# EAGLE design ssl (EAGLE 6.5.0)
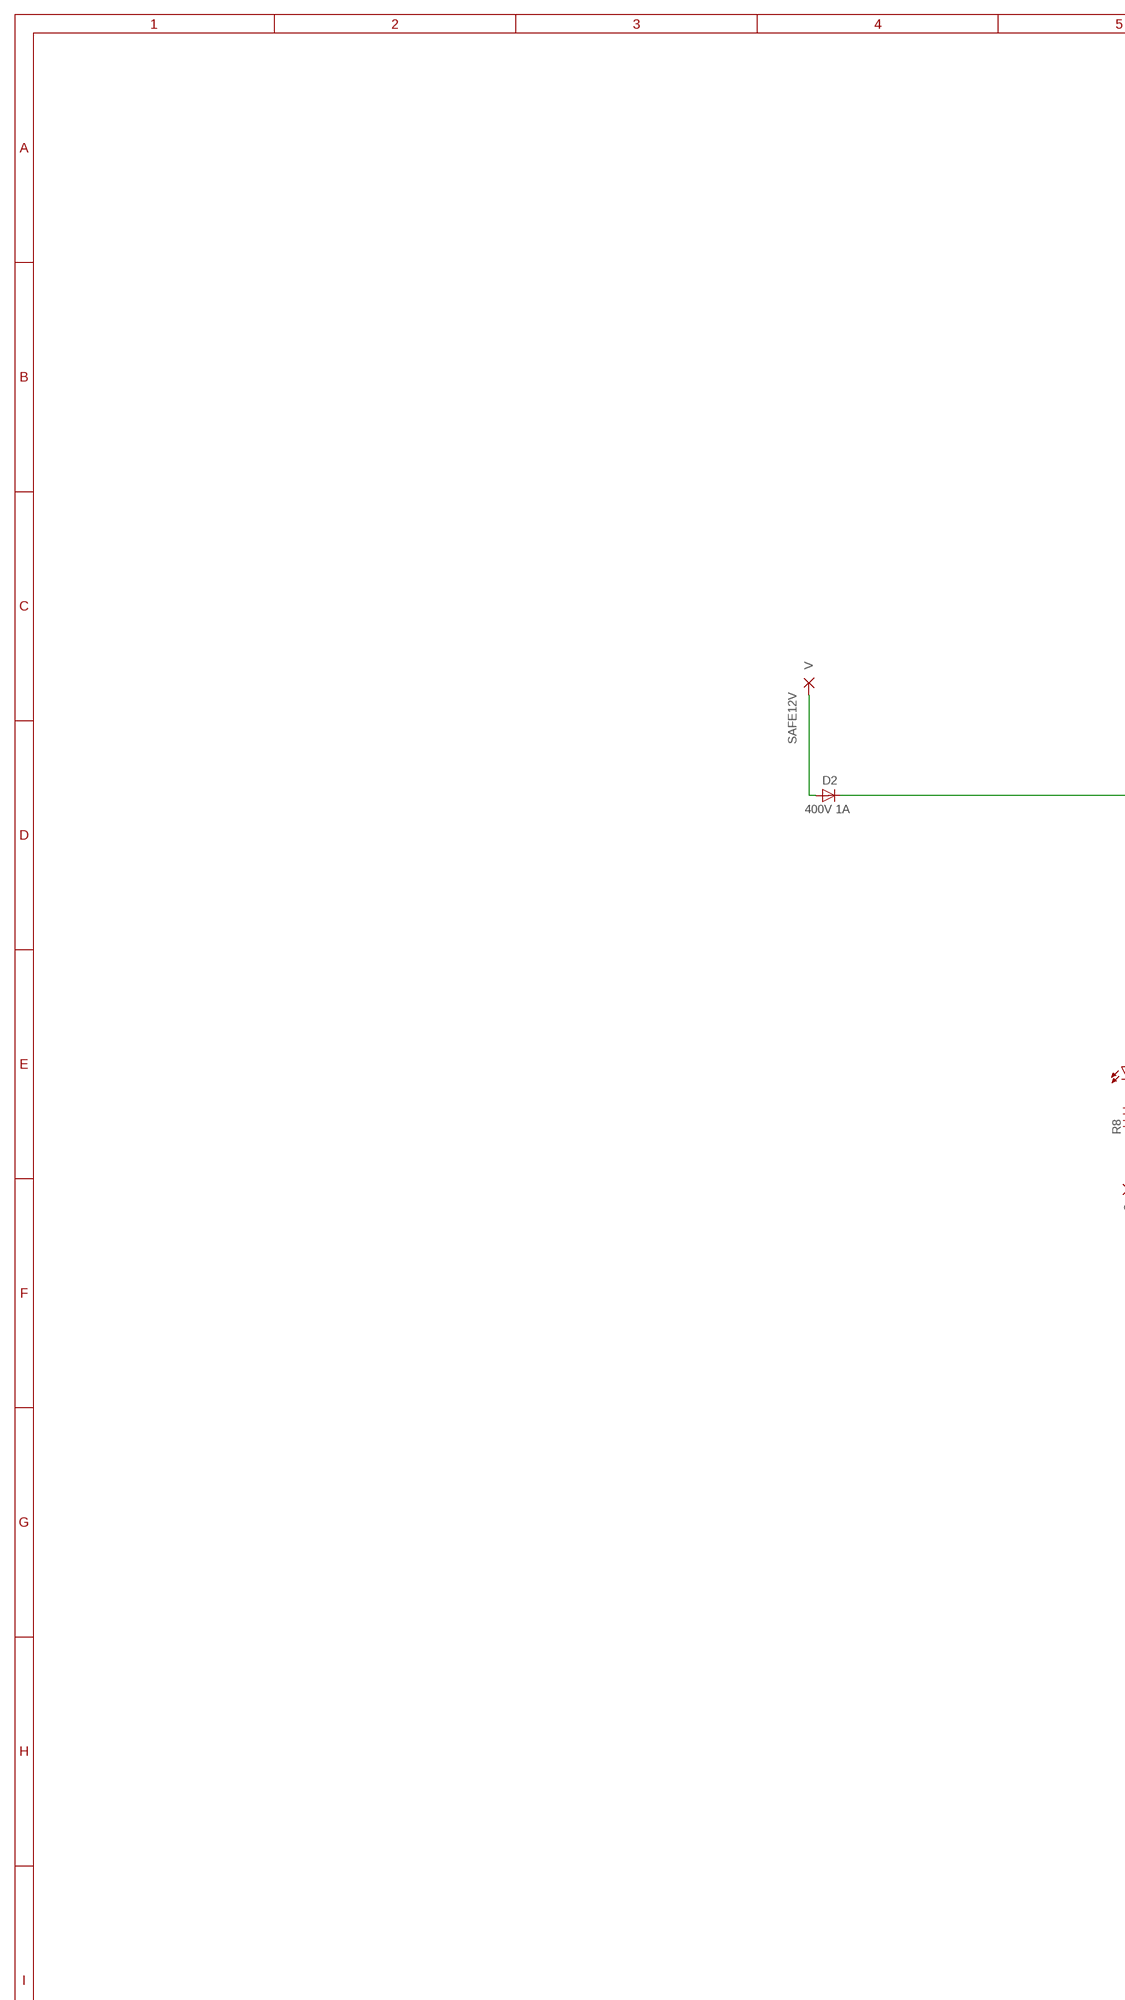
[diagram p0: schematic, sheet 1, part 1 of 2]
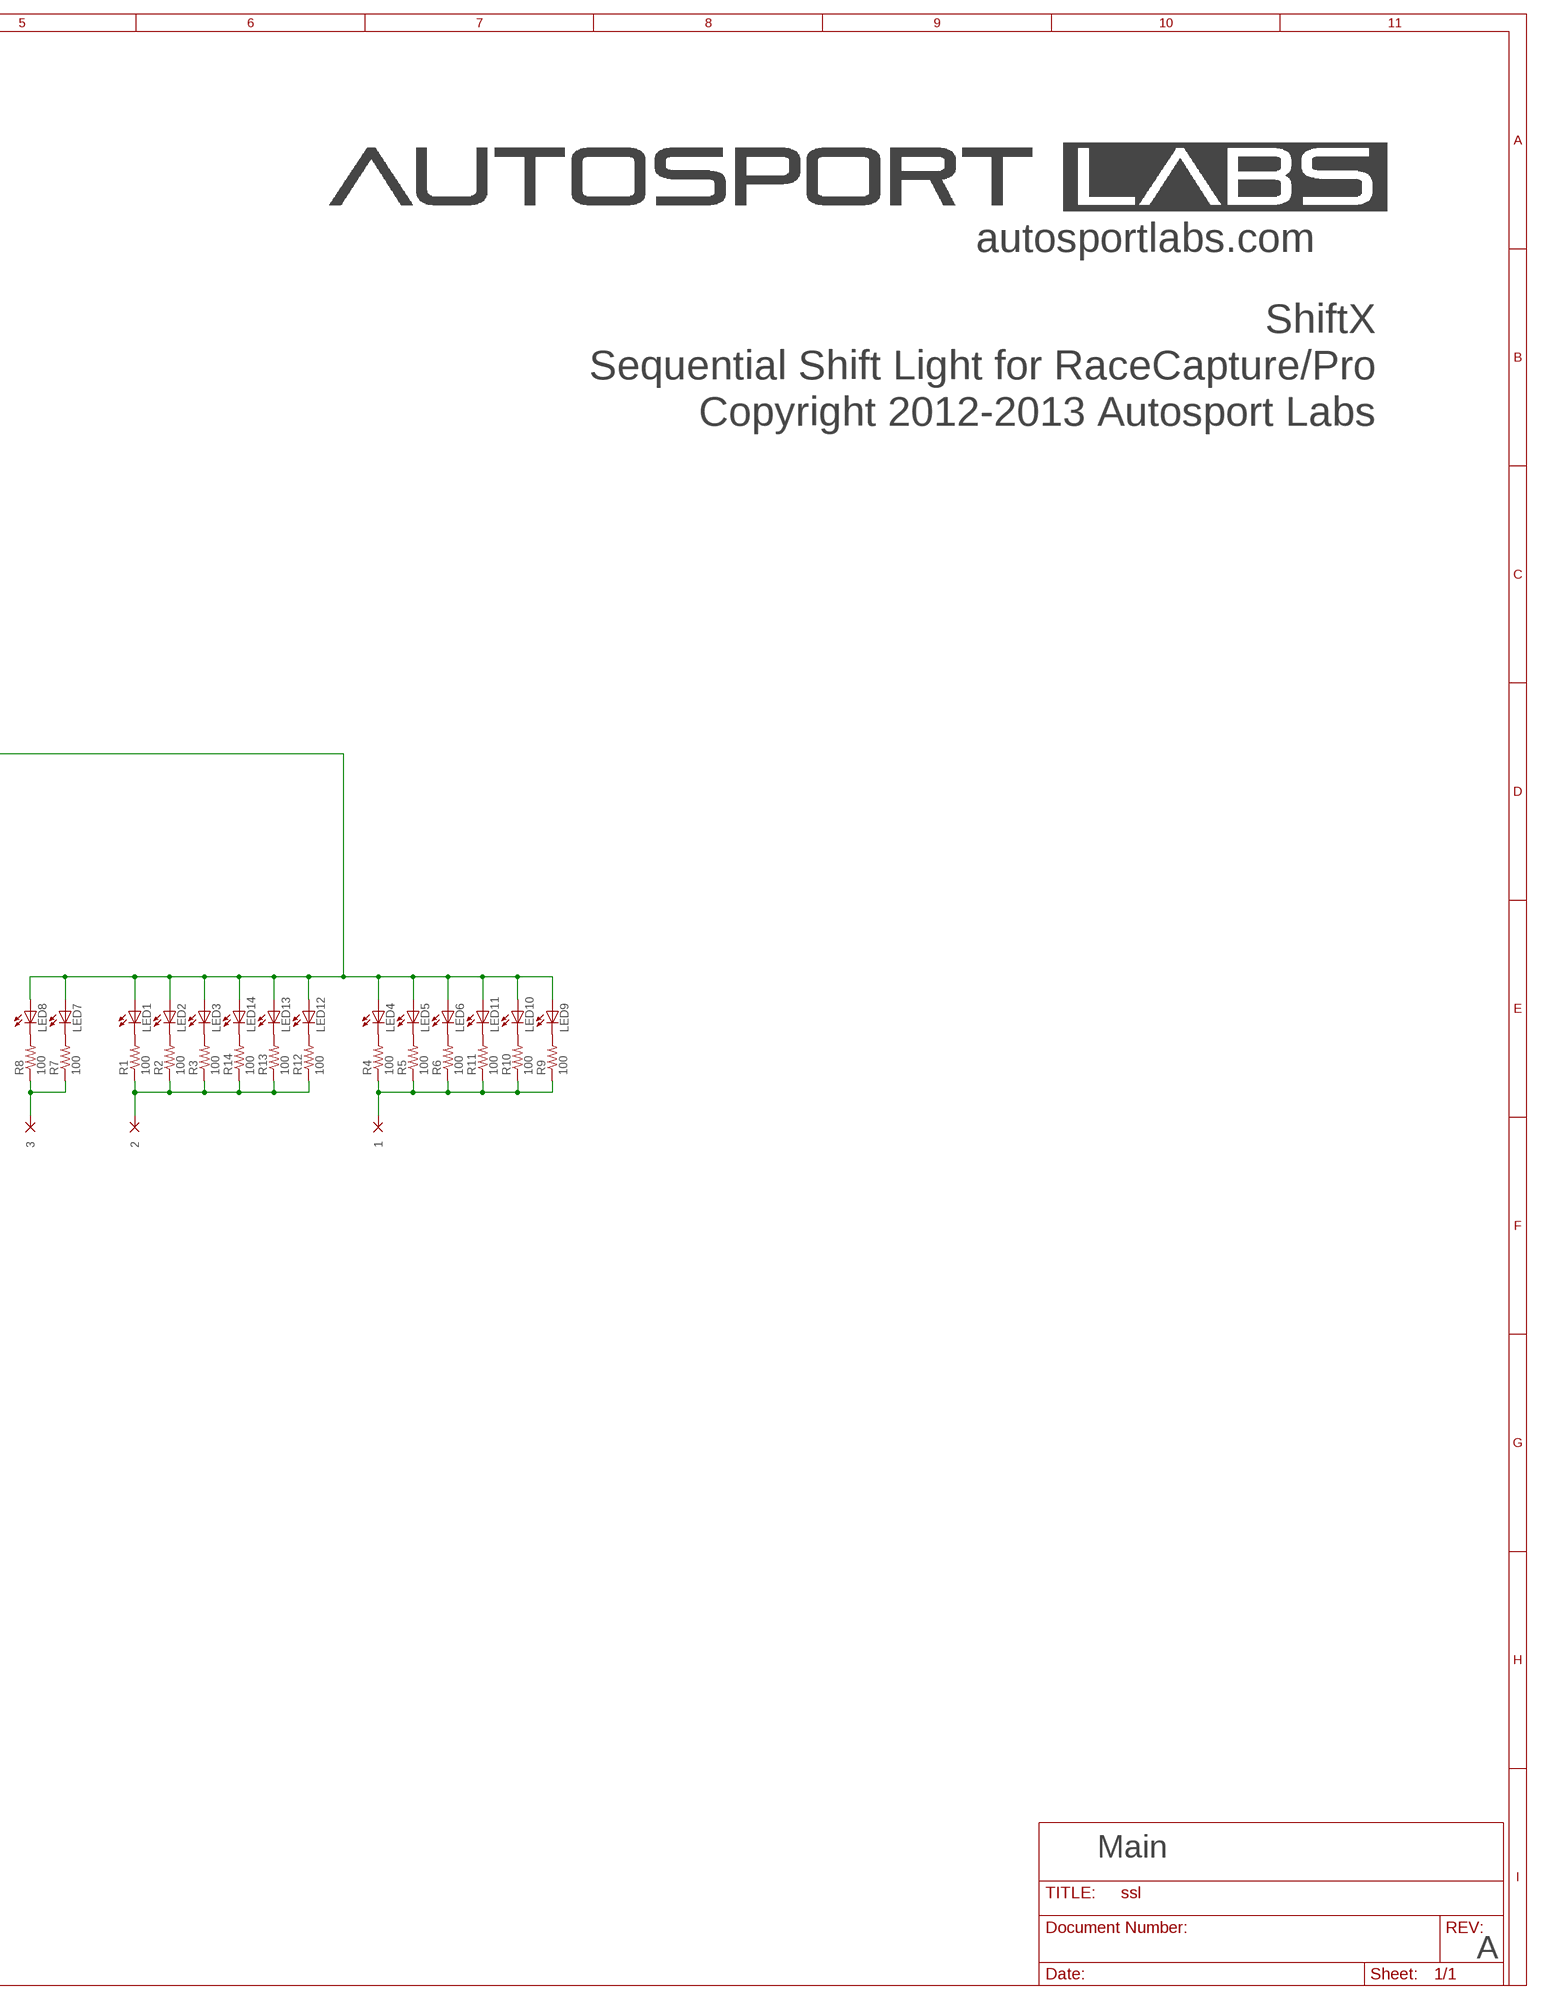
[diagram p1: schematic, sheet 1, part 2 of 2]

## Parts
1  WIREPAD2,15/1,0  [2,15/1,0]
2  WIREPAD2,15/1,0  [2,15/1,0]
3  WIREPAD2,15/1,0  [2,15/1,0]
D2  400V 1A  DIODE1  [SMA]
LED1  LEDP-LCC-2  [P-LCC-2]
LED2  LEDP-LCC-2  [P-LCC-2]
LED3  LEDP-LCC-2  [P-LCC-2]
LED4  LEDP-LCC-2  [P-LCC-2]
LED5  LEDP-LCC-2  [P-LCC-2]
LED6  LEDP-LCC-2  [P-LCC-2]
LED7  LEDP-LCC-2  [P-LCC-2]
LED8  LEDP-LCC-2  [P-LCC-2]
LED9  LEDP-LCC-2  [P-LCC-2]
LED10  LEDP-LCC-2  [P-LCC-2]
LED11  LEDP-LCC-2  [P-LCC-2]
LED12  LEDP-LCC-2  [P-LCC-2]
LED13  LEDP-LCC-2  [P-LCC-2]
LED14  LEDP-LCC-2  [P-LCC-2]
R1  100  R-US_R0603  [R0603]
R2  100  R-US_R0603  [R0603]
R3  100  R-US_R0603  [R0603]
R4  100  R-US_R0603  [R0603]
R5  100  R-US_R0603  [R0603]
R6  100  R-US_R0603  [R0603]
R7  100  R-US_R0603  [R0603]
R8  100  R-US_R0603  [R0603]
R9  100  R-US_R0603  [R0603]
R10  100  R-US_R0603  [R0603]
R11  100  R-US_R0603  [R0603]
R12  100  R-US_R0603  [R0603]
R13  100  R-US_R0603  [R0603]
R14  100  R-US_R0603  [R0603]
V  WIREPAD2,15/1,0  [2,15/1,0]

## Nets
N$1: LED8.C R8.2
N$2: LED7.C R7.2
N$3: LED1.C R1.2
N$4: LED2.C R2.2
N$5: LED3.C R3.2
N$6: LED14.C R14.2
N$7: LED13.C R13.2
N$8: LED12.C R12.2
N$9: LED4.C R4.2
N$10: LED5.C R5.2
N$11: LED6.C R6.2
N$12: LED11.C R11.2
N$13: LED10.C R10.2
N$14: LED9.C R9.2
N$15: 3.1(P) R7.1 R8.1
N$16: 2.1(P) R1.1 R2.1 R3.1 R12.1 R13.1 R14.1
N$17: 1.1(P) R4.1 R5.1 R6.1 R9.1 R10.1 R11.1
N$18: D2.C LED1.A LED2.A LED3.A LED4.A LED5.A LED6.A LED7.A LED8.A LED9.A LED10.A LED11.A LED12.A LED13.A LED14.A
SAFE12V: D2.A V.1(P)

## Notes on the sheet
- autosportlabs.com
- ShiftX
- Sequential Shift Light for RaceCapture/Pro
- Copyright 2012-2013 Autosport Labs
- Main
- A

## Library data of the parts
1-3 V = wirepad:WIREPAD: Wire PAD connect wire on PCB
D2 = smt_diodes:DIODE
LED1-LED14 = led:LED: LED OSRAM: - CHIPLED LG R971, LG N971, LY N971, LG Q971, LY Q971, LO R971, LY R971 LH N974, LH R974 LS Q976, LO Q976, LY Q976 LO Q996 - Hyper CHIPLED LW Q18S LB Q993, LB Q99A, LB R99A - SideLED LS A670, LO A670, LY A670, LG A670, LP A670 LB A673, LV A673, LT A673, LW A673 LH A674 LY A675 LS A676, LA A676, LO A676, LY A676, LW A676 LS A679, LY A679, LG A679 - Hyper Micro SIDELED® LS Y876, LA Y876, LO Y876, LY Y876 LT Y87S - SmartLED LW L88C, LW L88S LB L89C, LB L89S, LG L890 LS L89K, LO L89K, LY L89K LS L896, LA L896, LO L896, LY L896 - TOPLED LS T670, LO T670, LY T670, LG T670, LP T670 LSG T670, LSP T670, LSY T670, LOP T670, LYG T670 LG T671, LOG T671, LSG T671 LB T673, LV T673, LT T673, LW T673 LH T674 LS T676, LA T676, LO T676, LY T676, LB T676, LH T676, LSB T676, LW T676 LB T67C, LV T67C, LT T67C, LS T67K, LO T67K, LY T67K, LW E67C LS E67B, LA E67B, LO E67B, LY E67B, LB E67C, LV E67C, LT E67C LW T67C LS T679, LY T679, LG T679 LS T770, LO T770, LY T770, LG T770, LP T770 LB T773, LV T773, LT T773, LW T773 LH T774 LS E675, LA E675, LY E675, LS T675 LS T776, LA T776, LO T776, LY T776, LB T776 LHGB T686 LT T68C, LB T68C - Hyper Mini TOPLED® LB M676 - Mini TOPLED Santana® LG M470 LS M47K, LO M47K, LY M47K Source: http://www.osram.convergy.de LUXEON: - LUMILED® LXK2-PW12-R00, LXK2-PW12-S00, LXK2-PW14-U00, LXK2-PW14-V00 LXK2-PM12-R00, LXK2-PM12-S00, LXK2-PM14-U00 LXK2-PE12-Q00, LXK2-PE12-R00, LXK2-PE12-S00, LXK2-PE14-T00, LXK2-PE14-U00 LXK2-PB12-K00, LXK2-PB12-L00, LXK2-PB12-M00, LXK2-PB14-N00, LXK2-PB14-P00, LXK2-PB14-Q00 LXK2-PR12-L00, LXK2-PR12-M00, LXK2-PR14-Q00, LXK2-PR14-R00 LXK2-PD12-Q00, LXK2-PD12-R00, LXK2-PD12-S00 LXK2-PH12-R00, LXK2-PH12-S00 LXK2-PL12-P00, LXK2-PL12-Q00, LXK2-PL12-R00 Source: www.luxeon.com KINGBRIGHT: KA-3528ASYC Source: www.kingbright.com
R1-R14 = rcl:R-US_: RESISTOR, American symbol

## Board
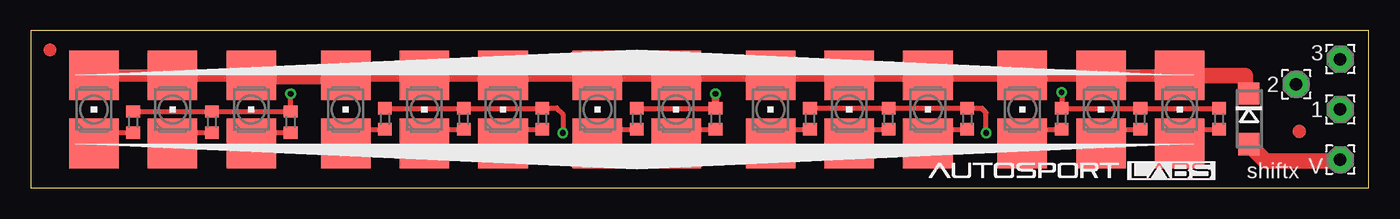
[diagram p2: board, top side]
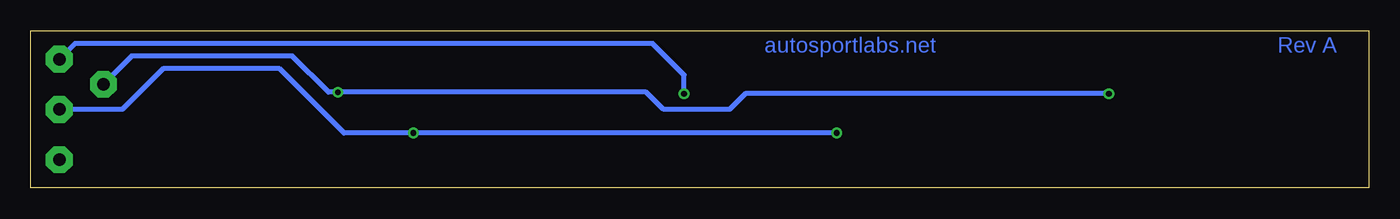
[diagram p3: board, bottom side, seen from below]

Size 107.95 x 12.7 mm. Coordinates in mm from the lower left corner, seen from the top.
Outline: 0,0 107.95,0 107.95,12.7 0,12.7 0,0
Copper layers (1*16): Top 0.035mm / dielectric 1.5mm / Bottom 0.035mm
Design rules "default *": minimum track width 10mil, minimum drill 16mil, track to track 8mil, track to pad 8mil, pad to pad 8mil, via to via 8mil, smd to smd 8mil, copper to edge 20mil, drill to drill 8mil, minimum pad ring 10mil, minimum via ring 8mil, stop-mask expansion 4mil, vias tented up to drill 24mil, thermal gap 10mil

### Footprints (pad centres in the part's own frame; a part is rotated, then mirrored left to right if it is on the bottom)
2,15/1,0 = drill 1.016 pad 2.159 octagon: 1 0,0
SMA = smd 1.8 x 1.7: A 2.05,0; C -2.05,0
P-LCC-2 = smd 4 x 4: A 0,2.75; C 0,-2.75
R0603 = smd 1 x 1.1: 1 -0.85,0; 2 0.85,0

### Placement (x,y rotation side)
1  105.66,6.35 0 top
2  102.11,8.38 0 top
3  105.66,10.41 0 top
D2  98.3,5.59 270 top
LED1  5.08,6.35 0 top
LED2  11.43,6.35 0 top
LED3  17.78,6.35 0 top
LED4  25.4,6.35 0 top
LED5  31.75,6.35 0 top
LED6  38.1,6.35 0 top
LED7  45.72,6.35 0 top
LED8  52.07,6.35 0 top
LED9  59.69,6.35 0 top
LED10  66.04,6.35 0 top
LED11  72.39,6.35 0 top
LED12  80.01,6.35 0 top
LED13  86.36,6.35 0 top
LED14  92.71,6.35 0 top
R1  8.26,5.33 270 top
R2  14.61,5.33 270 top
R3  20.95,5.33 270 top
R4  28.57,5.59 270 top
R5  34.93,5.59 270 top
R6  41.28,5.59 270 top
R7  48.9,5.59 270 top
R8  55.25,5.59 270 top
R9  62.87,5.59 270 top
R10  69.21,5.59 270 top
R11  75.56,5.59 270 top
R12  83.19,5.59 270 top
R13  89.53,5.59 270 top
R14  95.88,5.59 270 top
V  105.66,2.29 0 top

### Tracks (layer width: path | path; a pad name or v marks a point on that pad's centre or on a via)
N$1
  Top 0.406: R8.2 52.07,4.74 LED8.C
  Top 1.016: 52.2,2.2 LED8.C
N$2
  Top 0.406: R7.2 46.23,4.74 46.23,3.56 45.72,3.56 LED7.C
N$3
  Top 0.406: R1.2 5.08,4.48 LED1.C
N$4
  Top 0.406: R2.2 11.43,4.48 LED2.C
N$5
  Top 0.406: R3.2 17.78,4.48 LED3.C
N$6
  Top 0.406: R14.2 92.71,4.74 LED14.C
N$7
  Top 0.406: R13.2 86.36,4.74 LED13.C
N$8
  Top 0.406: R12.2 80.01,4.74 LED12.C
N$9
  Top 0.406: R4.2 25.4,4.74 LED4.C
N$10
  Top 0.406: R5.2 31.75,4.74 LED5.C
N$11
  Top 0.406: R6.2 38.1,4.74 LED6.C
N$12
  Top 0.406: R11.2 72.39,4.74 LED11.C
N$13
  Top 0.406: R10.2 66.04,4.74 LED10.C
N$14
  Top 0.406: R9.2 59.69,4.74 LED9.C
N$15  (via drill 0.46)
  Top 0.406: R7.1 R8.1
  Top 0.61: R8.1 v55.25,7.62
  Bottom 0.406: v55.25,7.62 55.25,9.14 57.79,11.68 104.39,11.68 3.1
N$16  (via drill 0.46)
  Top 0.406: v20.95,7.62 R3.1 R2.1 R1.1 | R14.1 R13.1 R12.1 v83.19,7.75
  Bottom 0.406: v20.95,7.62 50.29,7.62 51.56,6.35 56.9,6.35 58.29,7.75 v83.19,7.75 83.95,7.75 86.87,10.67 99.82,10.67 2.1
N$17  (via drill 0.46)
  Top 0.406: R9.1 R10.1 R11.1 76.75,6.44 77.09,6.1 v77.09,4.45 | R4.1 R5.1 R6.1 41.31,6.48 42.42,6.48 42.93,5.97 v42.93,4.45
  Bottom 0.406: 1.1 100.58,6.35 97.28,9.65 87.88,9.65 82.68,4.45 v77.09,4.45 v42.93,4.45
N$18
  Top 1.016: LED1.A LED2.A LED3.A 17.78,8.89 25.4,8.89 LED4.A LED5.A LED6.A LED7.A LED8.A | LED8.A 50.8,8.89 | LED8.A LED9.A LED10.A LED11.A LED12.A LED13.A LED14.A
  Top 1.27: 93.47,10.41 92.71,9.65 LED14.A 98,9.1 98,7.93 D2.C
SAFE12V
  Top 1.27: V.1 105.58,2.2 99.64,2.2 D2.A
(copper drawn outside any net)
  shapes: Top circle x2

### Text on the board
Bottom: Rev A | autosportlabs.net
tPlace: shiftx